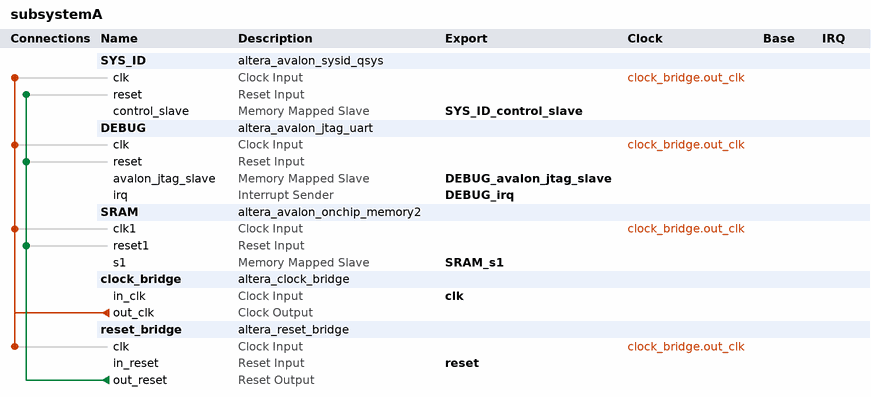
[diagram p0: system contents]
# Platform Designer (Qsys) system subsystemA, MAX 10 10M50DAF484C7G
# Parameters at their usual value, and those the tool derives, are not listed.
package require -exact qsys 18.1
create_system subsystemA
set_project_property DEVICE_FAMILY {MAX 10}
set_project_property DEVICE 10M50DAF484C7G

add_instance SYS_ID altera_avalon_sysid_qsys 18.1
set_instance_parameter_value SYS_ID id 0

add_instance DEBUG altera_avalon_jtag_uart 18.1
set_instance_parameter_value DEBUG simInteractiveOptions NO_INTERACTIVE_WINDOWS

add_instance SRAM altera_avalon_onchip_memory2 18.1
set_instance_parameter_value SRAM dataWidth 32
set_instance_parameter_value SRAM dualPort false
set_instance_parameter_value SRAM initMemContent false
set_instance_parameter_value SRAM initializationFileName onchip_mem.hex
set_instance_parameter_value SRAM memorySize 131072

add_instance clock_bridge altera_clock_bridge 18.1
set_instance_parameter_value clock_bridge DERIVED_CLOCK_RATE 0
set_instance_parameter_value clock_bridge EXPLICIT_CLOCK_RATE 0

add_instance reset_bridge altera_reset_bridge 18.1
set_instance_parameter_value reset_bridge ACTIVE_LOW_RESET 0
set_instance_parameter_value reset_bridge SYNCHRONOUS_EDGES deassert

# connections
add_connection clock_bridge.out_clk DEBUG.clk clock
add_connection clock_bridge.out_clk reset_bridge.clk clock
add_connection clock_bridge.out_clk SRAM.clk1 clock
add_connection clock_bridge.out_clk SYS_ID.clk clock
add_connection reset_bridge.out_reset DEBUG.reset reset
add_connection reset_bridge.out_reset SRAM.reset1 reset
add_connection reset_bridge.out_reset SYS_ID.reset reset

# exported interfaces
add_interface DEBUG_avalon_jtag_slave avalon slave
set_interface_property DEBUG_avalon_jtag_slave EXPORT_OF DEBUG.avalon_jtag_slave
add_interface DEBUG_irq interrupt sender
set_interface_property DEBUG_irq EXPORT_OF DEBUG.irq
add_interface SRAM_s1 avalon slave
set_interface_property SRAM_s1 EXPORT_OF SRAM.s1
add_interface SYS_ID_control_slave avalon slave
set_interface_property SYS_ID_control_slave EXPORT_OF SYS_ID.control_slave
add_interface clk clock sink
set_interface_property clk EXPORT_OF clock_bridge.in_clk
add_interface reset reset sink
set_interface_property reset EXPORT_OF reset_bridge.in_reset

set_interconnect_requirement {$system} qsys_mm.clockCrossingAdapter HANDSHAKE
set_interconnect_requirement {$system} qsys_mm.enableEccProtection FALSE
set_interconnect_requirement {$system} qsys_mm.insertDefaultSlave FALSE
set_interconnect_requirement {$system} qsys_mm.maxAdditionalLatency 1

save_system subsystemA.qsys
